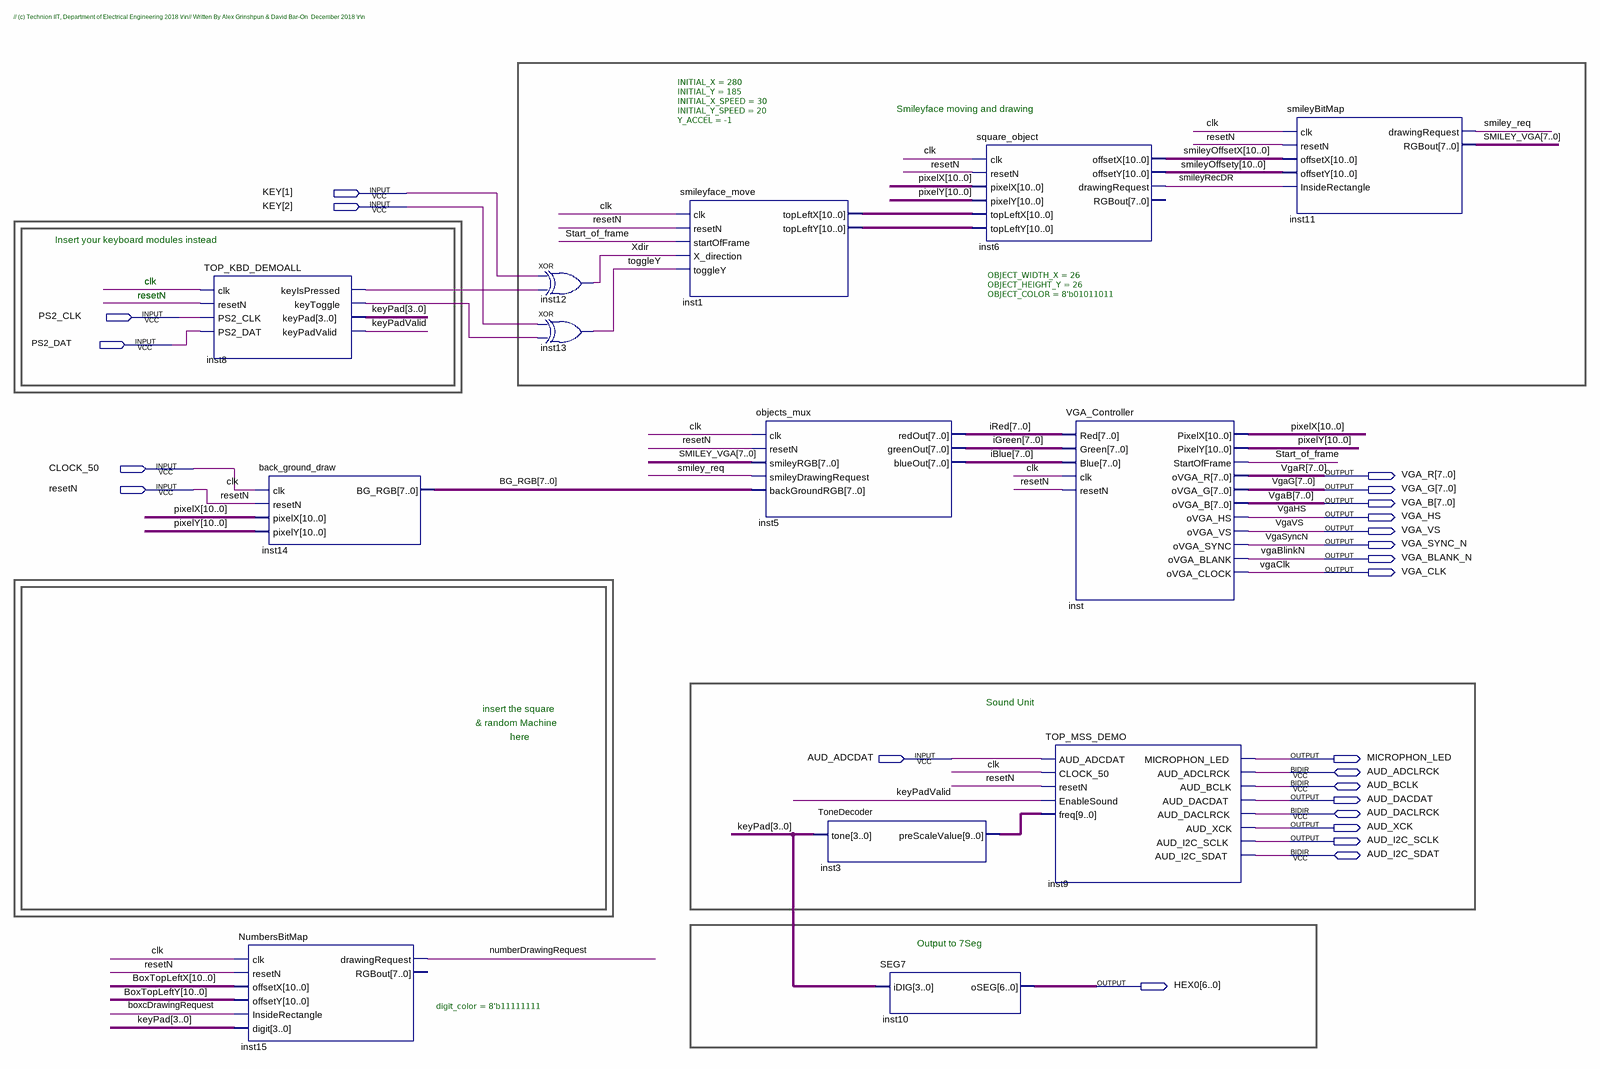
[diagram p0: schematic sheet]
// Quartus schematic TOP_VGA_DEMO_WITH_MSS.bdf as structural Verilog: 13 symbols, 24 pins
module TOP_VGA_DEMO_WITH_MSS (
  input  [2:1] KEY,
  input  PS2_CLK,
  input  PS2_DAT,
  input  CLOCK_50,
  input  resetN,
  input  AUD_ADCDAT,
  inout  AUD_ADCLRCK,
  inout  AUD_BCLK,
  inout  AUD_DACLRCK,
  inout  AUD_I2C_SDAT,
  output [7:0] VGA_R,
  output [7:0] VGA_G,
  output [7:0] VGA_B,
  output VGA_HS,
  output VGA_VS,
  output VGA_SYNC_N,
  output VGA_BLANK_N,
  output VGA_CLK,
  output MICROPHON_LED,
  output AUD_DACDAT,
  output AUD_XCK,
  output AUD_I2C_SCLK,
  output [6:0] HEX0
);

  wire boxcDrawingRequest, inst8_keyispressed, inst8_keytoggle, keyPadValid, numberDrawingRequest,
       smiley_req, smileyRecDR, Start_of_frame, toggleY, Xdir;
  wire [3:0] keyPad;
  wire [7:0] BG_RGB, iBlue, iGreen, iRed, SMILEY_VGA;
  wire [9:0] inst3_prescalevalue;
  wire [10:0] BoxTopLeftX, BoxTopLeftY, inst1_topleftx, inst1_toplefty, pixelX, pixelY, smileyOffsetX,
       smileyOffsety;

  TOP_KBD_DEMOALL inst8 (
    .clk(CLOCK_50), .resetN(resetN), .PS2_CLK(PS2_CLK), .PS2_DAT(PS2_DAT), .keyIsPressed(inst8_keyispressed),
    .keyToggle(inst8_keytoggle), .keyPad(keyPad), .keyPadValid(keyPadValid));
  back_ground_draw inst14 (.clk(CLOCK_50), .resetN(resetN), .pixelX(pixelX), .pixelY(pixelY), .BG_RGB(BG_RGB));
  NumbersBitMap #(.digit_color(8'b11111111)) inst15 (
    .clk(CLOCK_50), .resetN(resetN), .offsetX(BoxTopLeftX), .offsetY(BoxTopLeftY),
    .InsideRectangle(boxcDrawingRequest), .digit(keyPad), .drawingRequest(numberDrawingRequest));  // open: RGBout
  xor inst12 (Xdir, KEY[1], inst8_keyispressed);
  xor inst13 (toggleY, KEY[2], inst8_keytoggle);
  smileyface_move #(.INITIAL_X(280), .INITIAL_Y(185), .INITIAL_X_SPEED(30), .INITIAL_Y_SPEED(20), .Y_ACCEL(-1)) inst1 (
    .clk(CLOCK_50), .resetN(resetN), .startOfFrame(Start_of_frame), .X_direction(Xdir), .toggleY(toggleY),
    .topLeftX(inst1_topleftx), .topLeftY(inst1_toplefty));
  objects_mux inst5 (
    .clk(CLOCK_50), .resetN(resetN), .smileyRGB(SMILEY_VGA), .smileyDrawingRequest(smiley_req),
    .backGroundRGB(BG_RGB), .redOut(iRed), .greenOut(iGreen), .blueOut(iBlue));
  ToneDecoder inst3 (.tone(keyPad), .preScaleValue(inst3_prescalevalue));
  SEG7 inst10 (.iDIG(keyPad), .oSEG(HEX0));
  square_object #(.OBJECT_WIDTH_X(26), .OBJECT_HEIGHT_Y(26), .OBJECT_COLOR(8'b01011011)) inst6 (
    .clk(CLOCK_50), .resetN(resetN), .pixelX(pixelX), .pixelY(pixelY), .topLeftX(inst1_topleftx),
    .topLeftY(inst1_toplefty), .offsetX(smileyOffsetX), .offsetY(smileyOffsety), .drawingRequest(smileyRecDR));  // open: RGBout
  VGA_Controller inst (
    .Red(iRed), .Green(iGreen), .Blue(iBlue), .clk(CLOCK_50), .resetN(resetN), .PixelX(pixelX),
    .PixelY(pixelY), .StartOfFrame(Start_of_frame), .oVGA_R(VGA_R), .oVGA_G(VGA_G), .oVGA_B(VGA_B),
    .oVGA_HS(VGA_HS), .oVGA_VS(VGA_VS), .oVGA_SYNC(VGA_SYNC_N), .oVGA_BLANK(VGA_BLANK_N), .oVGA_CLOCK(VGA_CLK));
  TOP_MSS_DEMO inst9 (
    .AUD_ADCDAT(AUD_ADCDAT), .CLOCK_50(CLOCK_50), .resetN(resetN), .EnableSound(keyPadValid),
    .freq(inst3_prescalevalue), .MICROPHON_LED(MICROPHON_LED), .AUD_DACDAT(AUD_DACDAT), .AUD_XCK(AUD_XCK),
    .AUD_I2C_SCLK(AUD_I2C_SCLK), .AUD_ADCLRCK(AUD_ADCLRCK), .AUD_BCLK(AUD_BCLK), .AUD_DACLRCK(AUD_DACLRCK),
    .AUD_I2C_SDAT(AUD_I2C_SDAT));
  smileyBitMap inst11 (
    .clk(CLOCK_50), .resetN(resetN), .offsetX(smileyOffsetX), .offsetY(smileyOffsety),
    .InsideRectangle(smileyRecDR), .drawingRequest(smiley_req), .RGBout(SMILEY_VGA));

  // Other names for the same wires on the sheet: clk = CLOCK_50; VgaB[7:0] = VGA_B; vgaBlinkN = VGA_BLANK_N;
  //   vgaClk = VGA_CLK; VgaG[7:0] = VGA_G; VgaHS = VGA_HS; VgaR[7:0] = VGA_R; VgaSyncN = VGA_SYNC_N; VgaVS = VGA_VS

  // Notes on the sheet:
  //   // (c) Technion IIT, Department of Electrical Engineering 2018 \r\n// Written By Alex Grinshpun & David Bar-On  December 2018 \r\n
  //   Smileyface moving and drawing
  //   Insert your keyboard modules instead
  //   clk
  //   resetN
  //   Sound Unit
  //   insert the square
  //   & random Machine
  //   here
  //   Output to 7Seg
endmodule
